# EasyEDA schematic Maharani_Button.json
TITLE: Sheet_1; REV: 1.0; Date: 2025-01-16; Sheet: 1/1; Company: Your Company
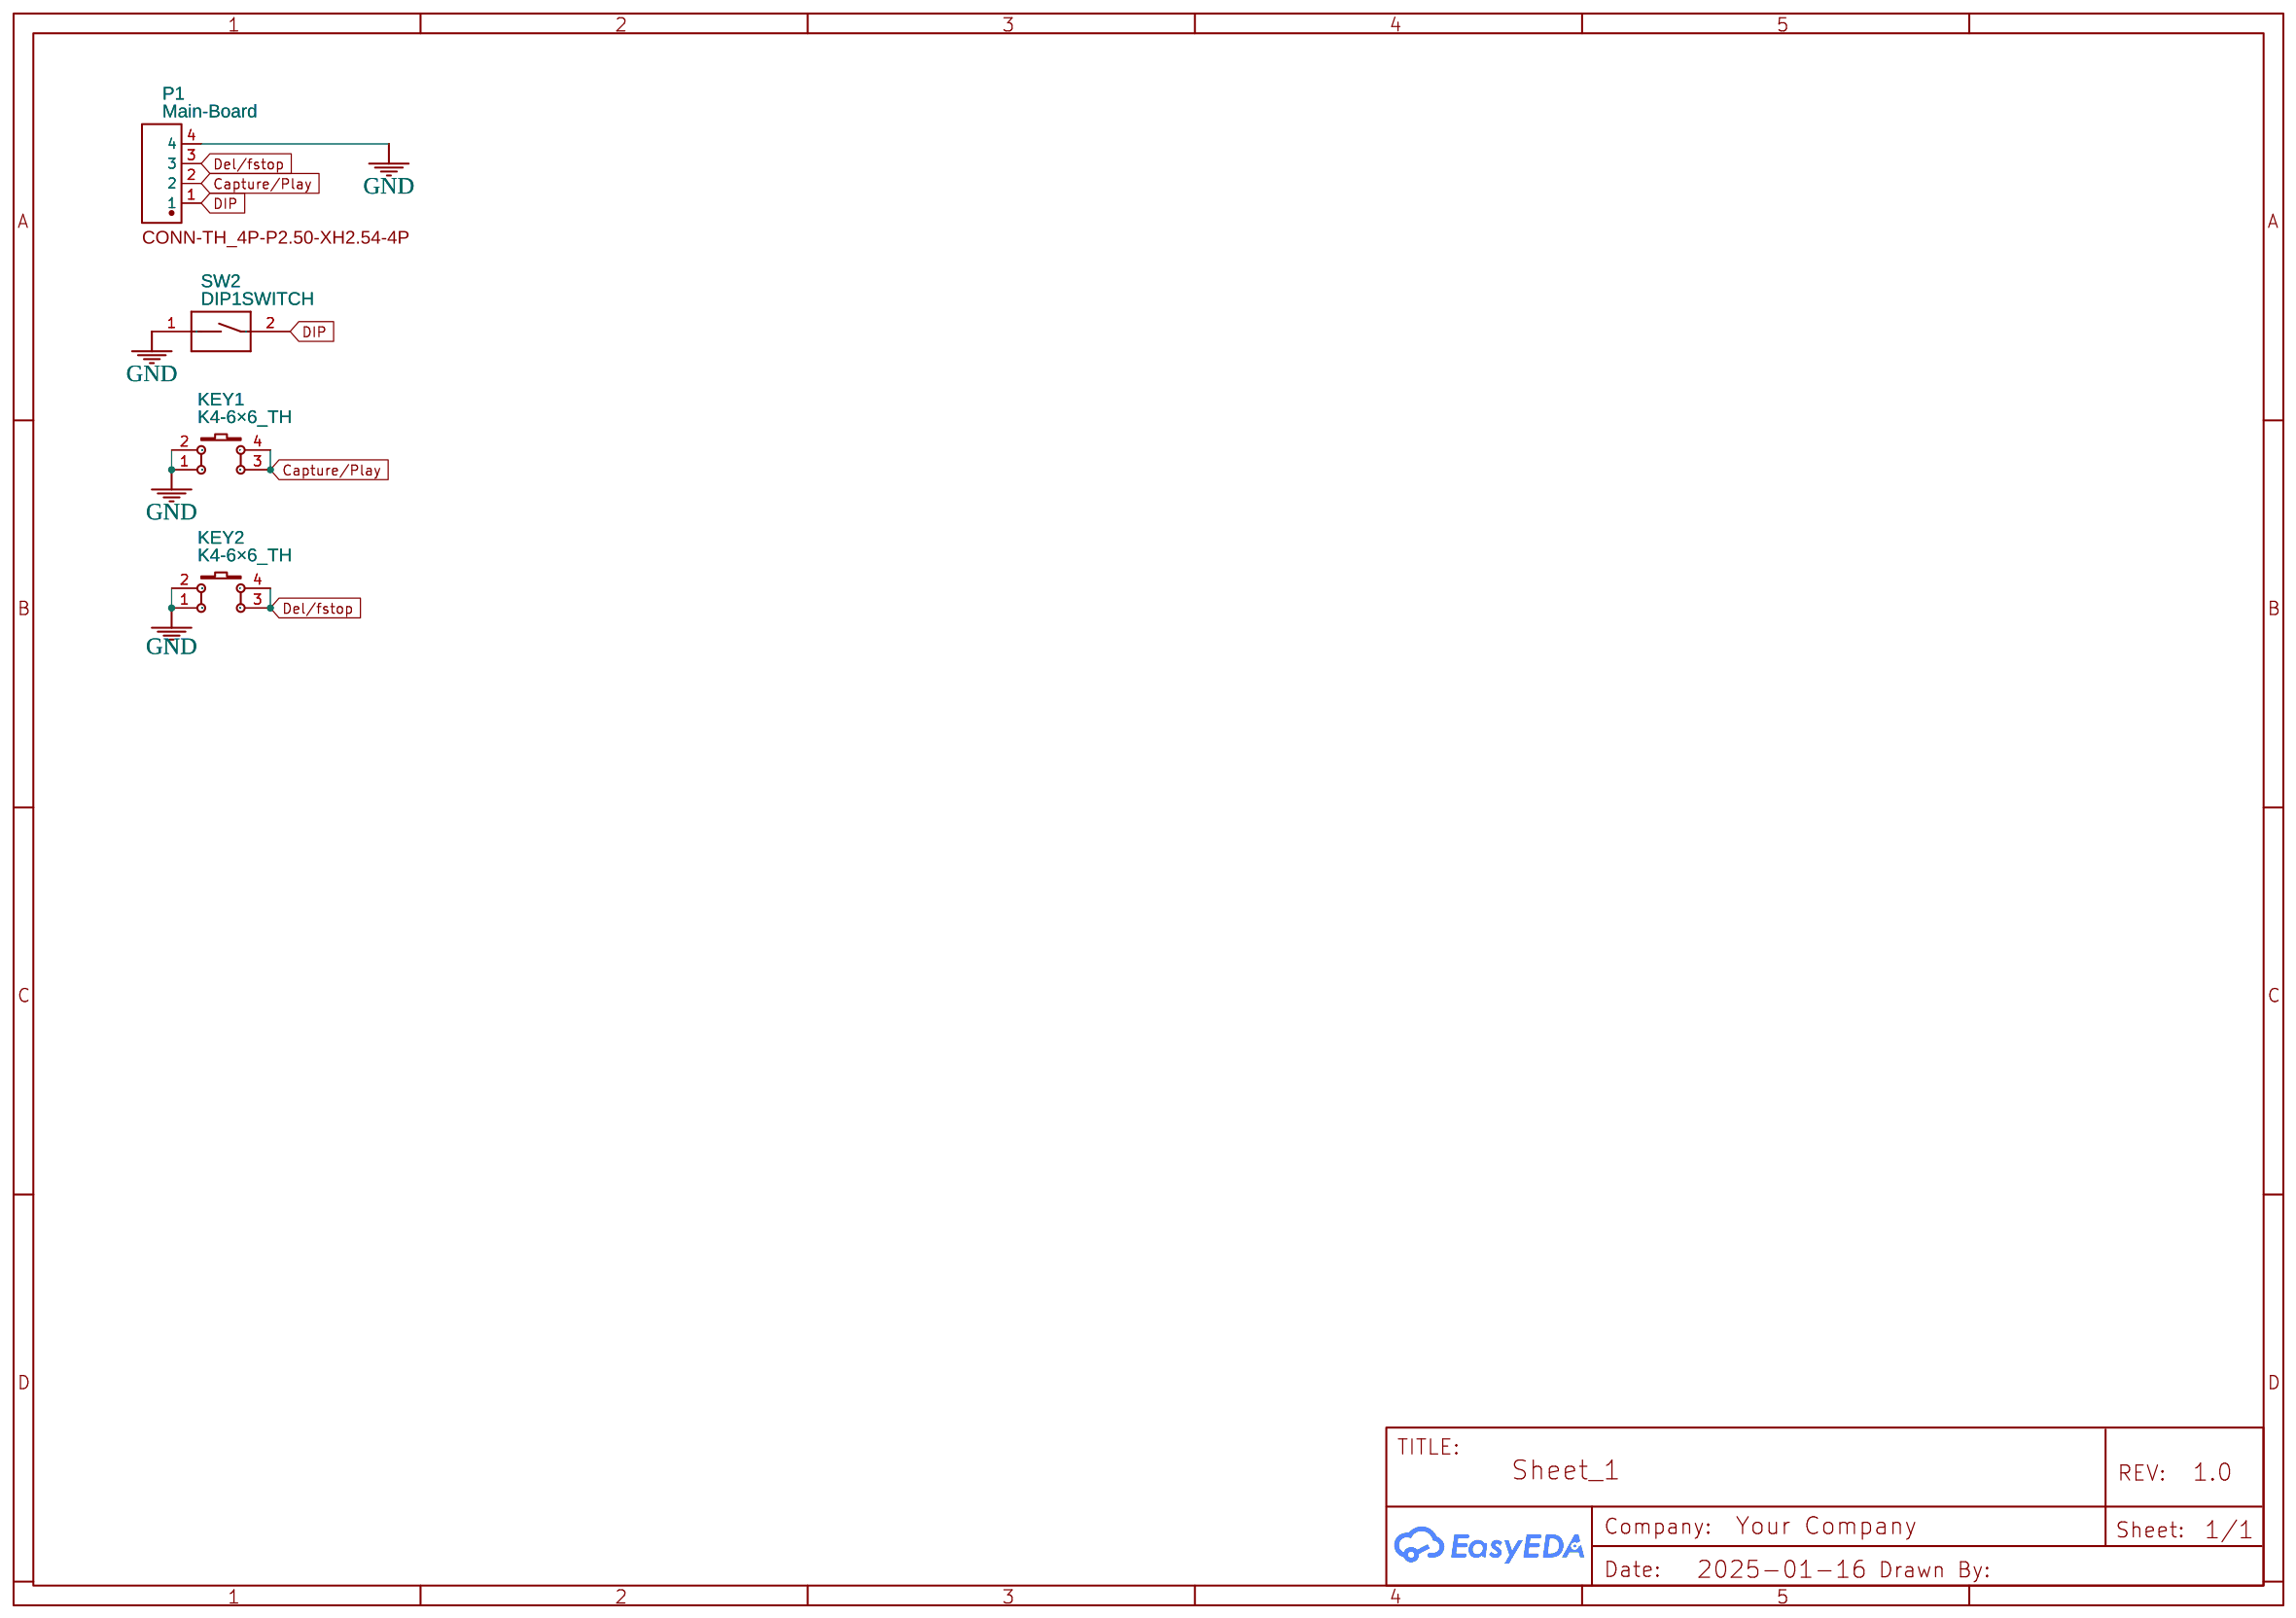
[diagram p0: schematic sheet]

## Parts
KEY1  K4-6×6_TH  [KEY-TH_4P-L6.0-W6.0-P4.50-LS6.5]
KEY2  K4-6×6_TH  [KEY-TH_4P-L6.0-W6.0-P4.50-LS6.5]
P1  Main-Board  [CONN-TH_4P-P2.50-XH2.54-4P]
SW2  DIP1SWITCH  [DIP SWITCH DIP1]

## Library data of the parts
KEY1 KEY2 = K4-6×6_TH: Supplier: LCSC; Supplier Part: C136684; Manufacturer: 韩国韩荣; Manufacturer Part: K2-1102DP-E4SW-04; Contributor: LCEDA_Lib; Package Display: No
P1 = XH-2.54-4P: Contributor: LCSC; Supplier: LCSC; Supplier Part: C9900003933; Manufacturer: null; Package Display: Yes
SW2 = DIP1SWITCH: Supplier: Digi-Key; Manufacturer: Omron Electronics Inc-EMC Div; Manufacturer Part: A6TN-1101; Supplier Part: Z12167-ND; Contributor: Willi_Billi; Package Display: No

## Nets
GND: KEY1.1 KEY1.2 KEY2.1 KEY2.2 P1.4 SW2.1
Capture/Play: KEY1.3 KEY1.4 P1.2
Del/fstop: KEY2.3 KEY2.4 P1.3
DIP: P1.1 SW2.2
